# Altium schematic sheet Programmable Stage.SchDoc
size A; SheetNumber: 2; SheetTotal: 3
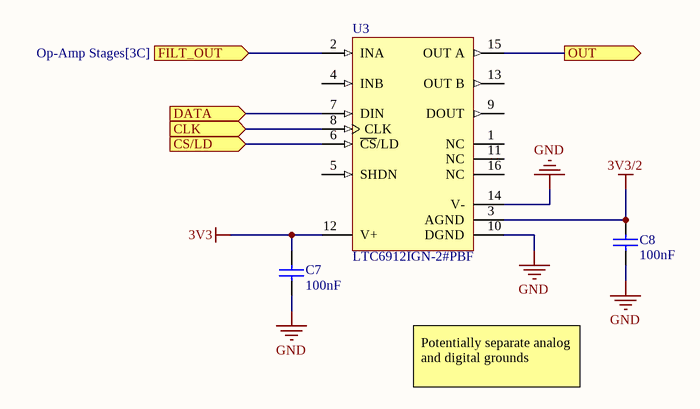
[diagram p0: Programmable Stage.SchDoc]

## Parts
C7  100nF  [RAD-0.3]
C8  100nF  [RAD-0.3]
U3  LTC6912IGN-2#PBF  [LT-GN-16_L]

## Ports
CLK (in), CS/LD (in), DATA (in), FILT_OUT (in, see Op-Amp Stages[3C]), OUT (out)

## Nets
3V3: C7.2 U3.12(V+)
3V3/2: C8.2 U3.3(AGND)
GND: C7.1 C8.1 U3.10(DGND) U3.14(V-)
CLK: U3.8(CLK) ; port CLK
CS/LD: U3.6(~{CS}/LD) ; port CS/LD
DATA: U3.7(DIN) ; port DATA
FILT_OUT: U3.2(INA) ; port FILT_OUT
OUT: U3.15(OUT_A) ; port OUT

Not connected (* = marked no-connect by the designer): U3 1(NC) 4(INB) 5(SHDN) 9(DOUT) 11(NC) 13(OUT_B) 16(NC)

## Notes on the sheet
- Potentially separate analog and digital grounds

## Library data of the parts
C7 C8 = Cap: Capacitor; Published: 8-Jun-2000; LatestRevisionDate: 17-Jul-2002; LatestRevisionNote: Re-released for DXP Platform.; PackageReference: RAD-0.3; Publisher: Altium Limited; PackageDescription: Radial Cap, Thru-Hole; 2 Leads; 0.3 in Pin Spacing
U3 = CMP-0359-00259-2: Dual Channel, Dual Programmable Gain Amplifier with Serial Digital Interface, 30 MHz Typical GBW, 16 V/us Typical SR, 2.7 to 10.5 V, 16-Pin SOP (GN-16), Industrial, Pb-Free; Manufacturer: Linear Technology; Linear Technology Part Number: LTC6912-2; Is (mA) Typical: 1.75; Vos (mV) Typical: 2; GBW (MHz) Typical: 30; SR (V/us) Typical: 16; Vs Max (V): 10.5; Vs Min (V): 2.7; Type: PGA; RevisionNote: URLs updated; DatasheetVersion: Rev. A; PackageDescription: 16-Lead Plastic SSOP, Body 4.9 x 3.9 mm, Pitch 0.635 mm; PartNumber: LTC6912IGN-2#PBF; ComponentLink3URL: http://cds.linear.com/docs/en/packaging/05081641_B_GN16.pdf; RoHS: Pb-Free; PackageVersion: Rev B; ComponentLink1URL: http://www.linear.com/; ComponentLink2URL: http://cds.linear.com/docs/en/datasheet/6912fa.pdf; ComponentLink2Description: Datasheet; Channels (#): 2; Mounting Technology: Surface Mount; ComponentLink1Description: Manufacturer URL; ComponentLink3Description: Package Specification; PackageReference: LT-GN-16